# EAGLE design LogiGSM (EAGLE 9.6.2)
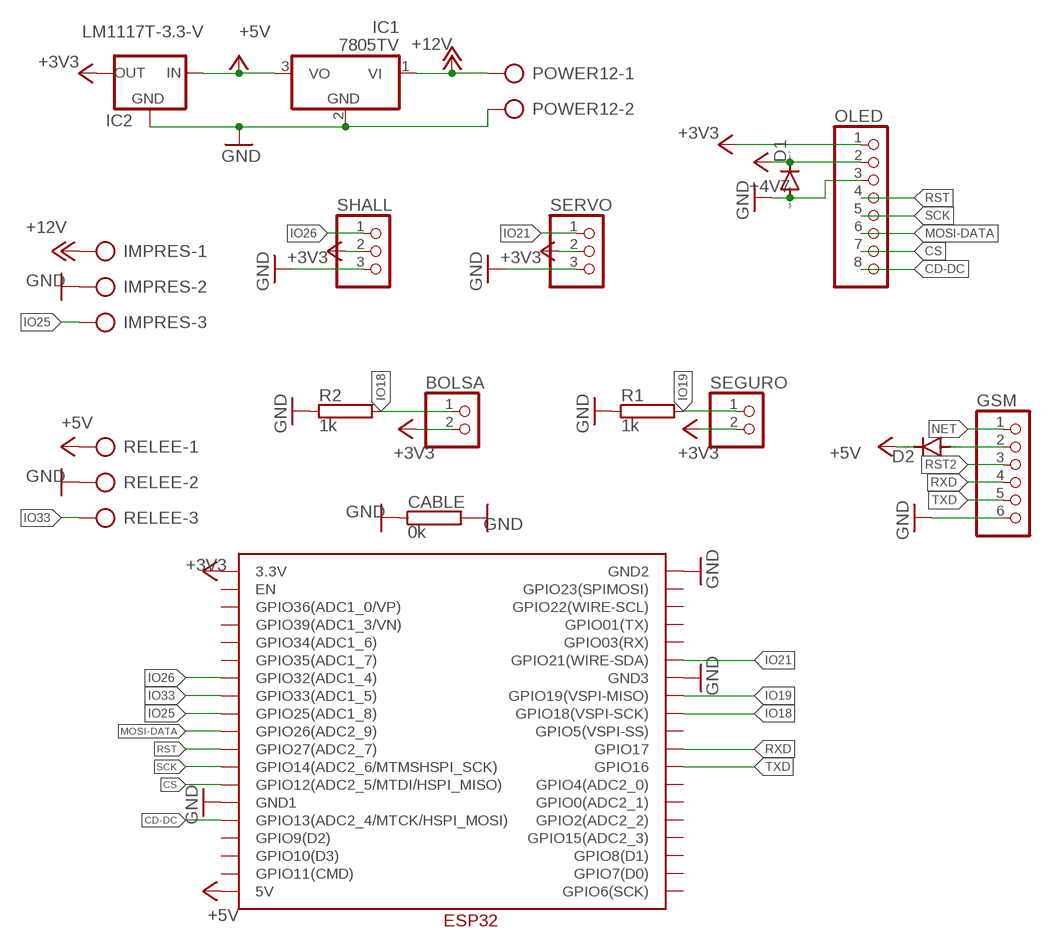
[diagram p0: schematic, sheet 1]

## Parts
BOLSA  PINHD-1X2  [1X02]
CABLE  0k  RRS1/2  [RS1/2]
D1  DIODE-SOD81  [SOD81]
D2  DIODE-SOD81  [SOD81]
GSM  PINHD-1X6  [1X06]
IC1  7805TV  [TO220V]
IC2  LM1117T-3.3-V  [TO220V]
IMPRES  AK500/3  [AK500/3]
OLED  PINHD-1X8  [1X08]
POWER12  AK500/2  [AK500/2]
R1  1k  RRS1/8  [RS1/8]
R2  1k  RRS1/8  [RS1/8]
RELEE  AK500/3  [AK500/3]
SEGURO  PINHD-1X2  [1X02]
SERVO  PINHD-1X3  [1X03]
SHALL  PINHD-1X3  [1X03]
U$1  ESP32WESP32W  [ESP32W]

## Nets
+3V3: BOLSA.2 IC2.2(OUT) OLED.1 SEGURO.2 SERVO.2 SHALL.2 U$1.3.3V
+5V: D1.C D2.C IC1.3(VO) IC2.3(IN) OLED.2 RELEE.1 U$1.5V ; supply symbol labelled +4V7
+12V: IC1.1(VI) IMPRES.1 POWER12.1
CD-DC: OLED.8 U$1.GPIO13(GPIO13(ADC2_4/MTCK/HSPI_MOSI))
CS: OLED.7 U$1.GPIO12(GPIO12(ADC2_5/MTDI/HSPI_MISO))
GND: CABLE.1 CABLE.2 D1.A GSM.6 IC1.2(GND) IC2.1(GND) IMPRES.2 OLED.3 POWER12.2 R1.1 R2.1 RELEE.2 SERVO.3 SHALL.3 U$1.GND1 U$1.GND2 U$1.GND3
IO18: BOLSA.1 R2.2 U$1.GPIO18(GPIO18(VSPI-SCK))
IO19: R1.2 SEGURO.1 U$1.GPIO19(GPIO19(VSPI-MISO))
IO21: SERVO.1 U$1.GPIO21(GPIO21(WIRE-SDA))
IO25: IMPRES.3 U$1.GPIO25(GPIO25(ADC1_8))
IO26: SHALL.1 U$1.GPIO32(GPIO32(ADC1_4))
IO33: RELEE.3 U$1.GPIO33(GPIO33(ADC1_5))
MOSI-DATA: OLED.6 U$1.GPIO26(GPIO26(ADC2_9))
N$1: D2.A GSM.2
NET: GSM.1
RST: OLED.4 U$1.GPIO27(GPIO27(ADC2_7))
RST2: GSM.3
RXD: GSM.4 U$1.GPIO17
SCK: OLED.5 U$1.GPIO14(GPIO14(ADC2_6/MTMSHSPI_SCK))
TXD: GSM.5 U$1.GPIO16
Unconnected: U$1.CLK(GPIO6(SCK)) U$1.CMD(GPIO11(CMD)) U$1.D2(GPIO9(D2)) U$1.D3(GPIO10(D3)) U$1.EN U$1.GPIO0(GPIO0(ADC2_1)) U$1.GPIO2(GPIO2(ADC2_2)) U$1.GPIO4(GPIO4(ADC2_0)) U$1.GPIO5(GPIO5(VSPI-SS)) U$1.GPIO15(GPIO15(ADC2_3)) U$1.GPIO22(GPIO22(WIRE-SCL)) U$1.GPIO23(GPIO23(SPIMOSI)) U$1.GPIO34(GPIO34(ADC1_6)) U$1.GPIO35(GPIO35(ADC1_7)) U$1.RX(GPIO03(RX)) U$1.SDI(GPIO8(D1)) U$1.SDO(GPIO7(D0)) U$1.TX(GPIO01(TX)) U$1.VN(GPIO39(ADC1_3/VN)) U$1.VP(GPIO36(ADC1_0/VP))

## Library data of the parts
BOLSA SEGURO = pinhead:PINHD-1X2: PIN HEADER
CABLE = resistor-power:R: Power Resitor; MF: OHMITE; MPN: RRS1K0E; OC_FARNELL: 1762006; OC_NEWARK: 64K5942
D1 D2 = diode:DIODE-: DIODE
GSM = pinhead:PINHD-1X6: PIN HEADER
IC1 = linear:78*: Positive VOLTAGE REGULATOR Source: http://cache.national.com/ds/LM/LM78L05.pdf http://www.fairchildsemi.com/ds/LM/LM7805.pdf
IC2 = lm1117:LM1117T-*
IMPRES RELEE = con-ptr500:AK500/3: CONNECTOR; OC_FARNELL: unknown; OC_NEWARK: unknown
OLED = pinhead:PINHD-1X8: PIN HEADER
POWER12 = con-ptr500:AK500/2: CONNECTOR; OC_FARNELL: unknown; OC_NEWARK: unknown
R1 R2 = resistor-powerV2:R: Power Resitor; OC_FARNELL: unknown; OC_NEWARK: unknown
SERVO SHALL = pinhead:PINHD-1X3: PIN HEADER
U$1 = ESP32-WROOM2:ESP32W

## Board
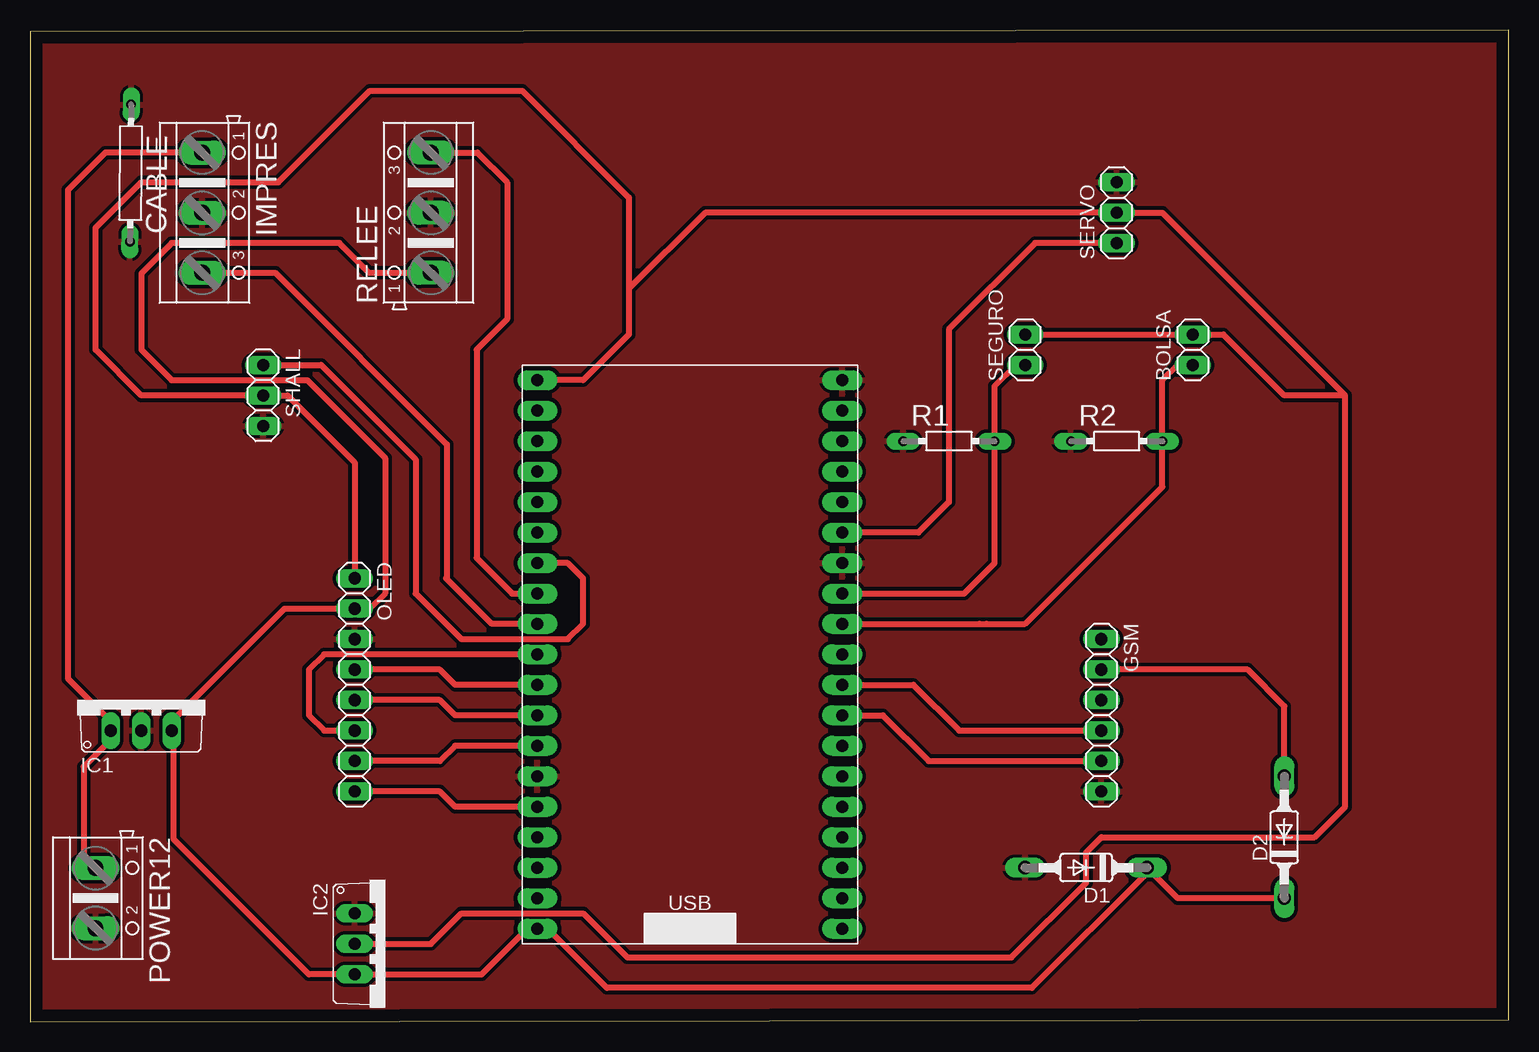
[diagram p1: board, top side]
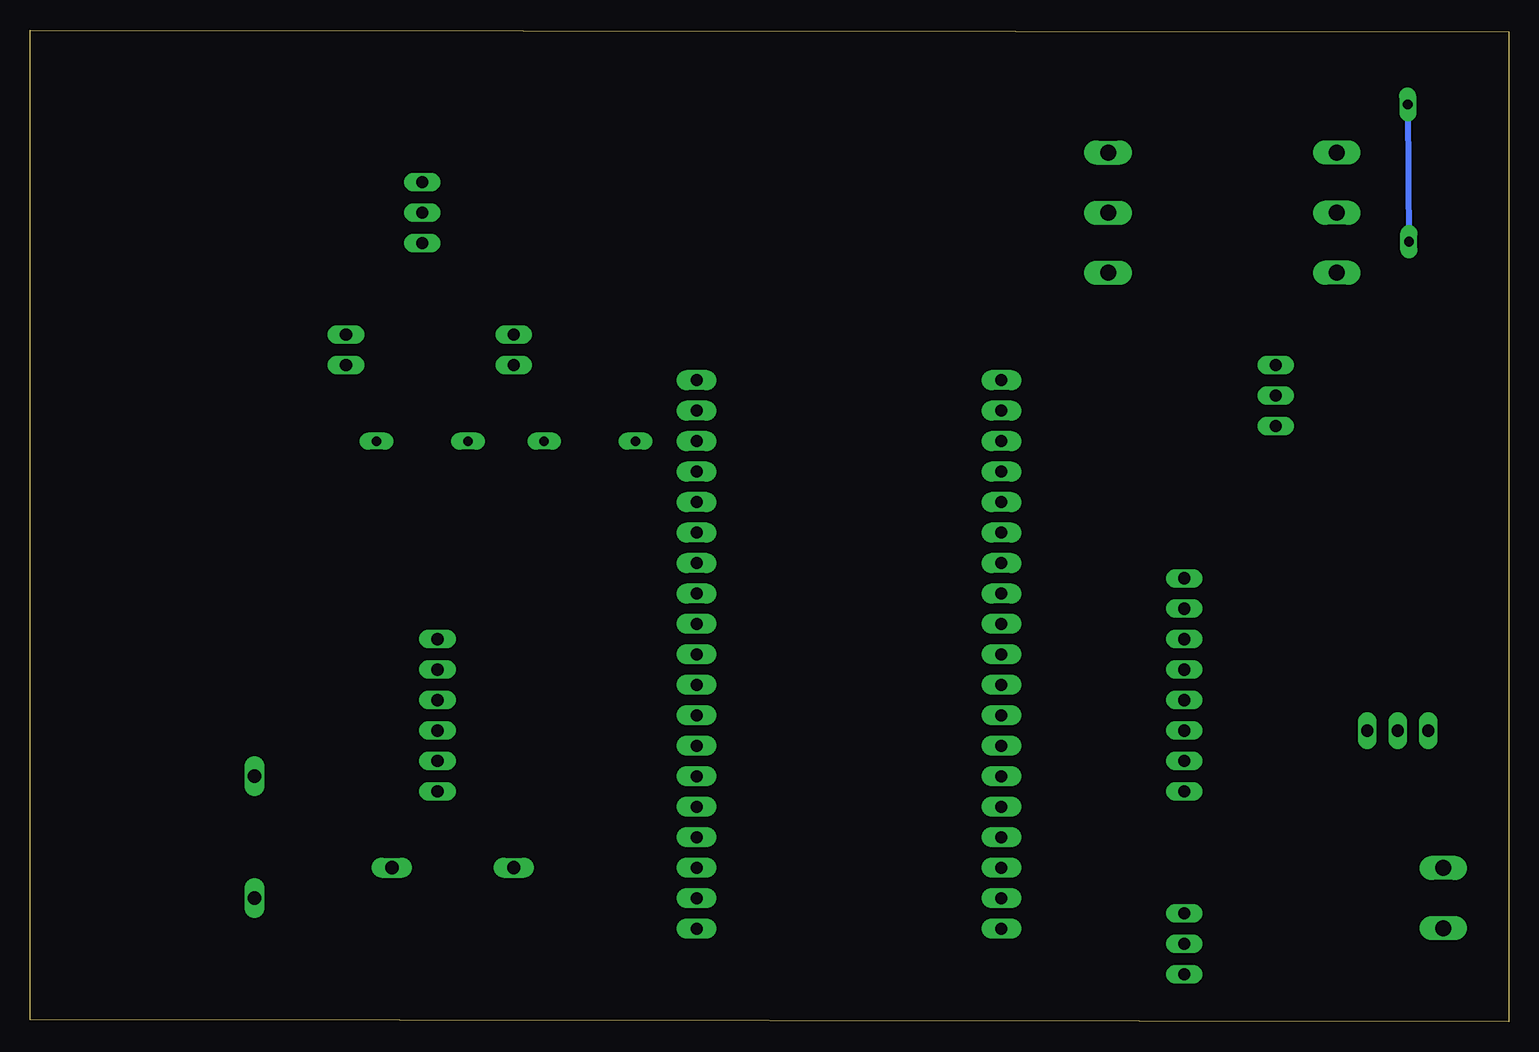
[diagram p2: board, bottom side, seen from below]

Size 123.24 x 82.67 mm. Coordinates in mm from the lower left corner, seen from the top.
Outline: 0,0 123.24,0.13 123.24,82.67 0,82.54 0,0
Copper layers (1*16): Top 0.04mm / dielectric 1.5mm / Bottom 0.04mm
Design rules "default *": minimum track width 0.5mm, minimum drill 0.35mm, track to track 12mil, track to pad 6mil, pad to pad 6mil, via to via 6mil, smd to smd 6mil, copper to edge 40mil, drill to drill 6mil, minimum pad ring 10mil, minimum via ring 8mil, stop-mask expansion 4mil, vias tented up to drill 0mil, thermal gap 10mil

### Footprints (pad centres in the part's own frame; a part is rotated, then mirrored left to right if it is on the bottom)
1X02 = drill 1.016 long: 1 -1.27,0; 2 1.27,0
RS1/2 = drill 0.8 pad 1.4 long: 1 -5.715,0; 2 5.715,0
SOD81 = drill 1.118 long: A 5.08,0; C -5.08,0
1X06 = drill 1.016 long: 1 -6.35,0; 2 -3.81,0; 3 -1.27,0; 4 1.27,0; 5 3.81,0; 6 6.35,0
TO220V = drill 1.016 long: 1 -2.54,-2.54; 2 0,-2.54; 3 2.54,-2.54
AK500/3 = drill 1.321 long: 1 -5.004,0; 2 0,0; 3 5.004,0
1X08 = drill 1.016 long: 1 -8.89,0; 2 -6.35,0; 3 -3.81,0; 4 -1.27,0; 5 1.27,0; 6 3.81,0; 7 6.35,0; 8 8.89,0
AK500/2 = drill 1.321 long: 1 -2.515,0; 2 2.515,0
RS1/8 = drill 0.8 pad 1.4 long: 1 -3.81,0; 2 3.81,0
1X03 = drill 1.016 long: 1 -2.54,0; 2 0,0; 3 2.54,0
ESP32W = drill 1 pad 1.676 long: 3.3V 1.27,46.99; 5V 1.27,1.27; CLK 26.67,1.27; CMD 1.27,3.81; D2 1.27,8.89; D3 1.27,6.35; EN 1.27,44.45; GND1 1.27,13.97; GND2 26.67,46.99; GND3 26.67,31.75; GPIO0 26.67,13.97; GPIO2 26.67,11.43; GPIO4 26.67,16.51; GPIO5 26.67,24.13; GPIO12 1.27,16.51; GPIO13 1.27,11.43; GPIO14 1.27,19.05; GPIO15 26.67,8.89; GPIO16 26.67,19.05; GPIO17 26.67,21.59; GPIO18 26.67,26.67; GPIO19 26.67,29.21; GPIO21 26.67,34.29; GPIO22 26.67,41.91; GPIO23 26.67,44.45; GPIO25 1.27,26.67; GPIO26 1.27,24.13; GPIO27 1.27,21.59; GPIO32 1.27,31.75; GPIO33 1.27,29.21; GPIO34 1.27,36.83; GPIO35 1.27,34.29; RX 26.67,36.83; SDI 26.67,6.35; SDO 26.67,3.81; TX 26.67,39.37; VN 1.27,39.37; VP 1.27,41.91

### Placement (x,y rotation side)
BOLSA  96.9,56.01 90 top
CABLE  8.38,70.74 269.5 top
D1  88.01,12.83 180 top
D2  104.52,15.37 90 top
GSM  89.28,25.53 270 top
IC1  9.27,26.8 0 top
IC2  29.59,6.48 270 top
IMPRES  14.35,67.44 270 top
OLED  27.05,28.07 270 top
POWER12  5.46,10.29 270 top
R1  76.58,48.39 0 top
R2  90.55,48.39 0 top
RELEE  33.4,67.44 90 top
SEGURO  82.93,56.01 90 top
SERVO  90.55,67.44 90 top
SHALL  19.43,52.2 270 top
U$1  41.02,6.48 0 top

### Tracks (layer width: path | path; a pad name or v marks a point on that pad's centre or on a via)
+3V3
  Top 0.5: 43.13,53.47 U$1.3.3V 46.1,53.47 49.91,57.28 49.91,61.09 | 20.19,52.2 SHALL.2 | SEGURO.2 BOLSA.2 99.44,57.28 104.52,52.2 109.6,52.2 | SHALL.2 9.27,52.2 5.46,56.01 5.46,66.17 9.27,69.98 20.7,69.98 28.32,77.6 41.02,77.6 49.91,68.71 49.91,61.09 | 109.6,52.2 109.6,17.91 107.06,15.37 89.28,15.37 88.01,14.1 88.01,11.56 81.79,5.33 49.78,5.33 46.1,9.02 35.94,9.02 33.4,6.48 IC2.2 | 109.6,52.2 94.36,67.44 SERVO.2 56.26,67.44 49.91,61.09 | SHALL.2 21.46,52.2 27.05,46.61 OLED.1
  Bottom 0.5: 20.19,52.2 SHALL.2
+5V
  Top 0.5: OLED.2 21.21,34.42 11.81,25.02 IC1.3 11.94,24.13 11.94,15.24 23.24,3.94 IC2.3 37.64,3.94 41.45,7.75 U$1.5V 43.13,7.75 48.08,2.79 83.49,2.79 93.09,12.39 D1.C 95.63,10.29 D2.C | 26.29,34.42 OLED.2 | OLED.2 28.32,34.42 29.59,35.69 29.59,46.99 23.11,53.47 11.81,53.47 9.27,56.01 9.27,62.36 11.81,64.9 25.78,64.9 28.24,62.43 RELEE.1
+12V
  Top 0.5: POWER12.1 4.47,12.8 4.47,21.23 6.73,23.5 IC1.1 6.73,25.02 3.18,28.57 3.18,69.34 6.27,72.44 IMPRES.1
CD-DC
  Top 0.5: U$1.GPIO13 35.43,17.91 34.16,19.18 OLED.8
CS
  Top 0.5: U$1.GPIO12 35.43,22.99 34.16,21.72 OLED.7
GND
  Bottom 0.5: CABLE.1 8.38,70.36 CABLE.2
  pour Top: 1.14,82.04 1.14,0.25 122.3,0.25 122.3,82.04
IO18
  Top 0.5: U$1.GPIO18 79.12,33.15 79.69,33.15 82.93,33.15 94.36,44.58 R2.2 94.36,53.47 95.63,54.74 BOLSA.1
IO19
  Top 0.5: SEGURO.1 82.17,54.74 80.39,52.96 R1.2 80.39,38.23 77.85,35.69 U$1.GPIO19
IO21
  Top 0.5: SERVO.1 83.77,64.9 76.58,57.71 76.58,43.31 74.04,40.77 U$1.GPIO21
IO25
  Top 0.5: IMPRES.3 20.42,62.43 34.74,48.12 34.74,36.96 34.67,36.96 38.48,33.15 U$1.GPIO25
IO26
  Top 0.5: U$1.GPIO32 44.83,38.23 46.1,36.96 46.1,33.15 44.83,31.88 35.94,31.88 32.13,35.69 32.13,46.86 24.26,54.74 SHALL.1
IO33
  Top 0.5: U$1.GPIO33 40.18,35.69 37.21,38.66 37.21,56.01 39.75,58.55 39.75,69.98 37.29,72.44 RELEE.3
MOSI-DATA
  Top 0.5: U$1.GPIO26 24.51,30.61 23.24,29.34 23.24,25.53 24.51,24.26 OLED.6
N$1
  Top 0.5: D2.A 104.52,26.29 101.47,29.34 GSM.2
RST
  Top 0.5: U$1.GPIO27 35.43,28.07 34.16,29.34 OLED.4
RXD
  Top 0.5: U$1.GPIO17 73.61,28.07 77.42,24.26 GSM.4
SCK
  Top 0.5: U$1.GPIO14 35.43,25.53 34.16,26.8 OLED.5
TXD
  Top 0.5: U$1.GPIO16 71.07,25.53 74.88,21.72 GSM.5